# EAGLE design PowerBoard (EAGLE 6.5.0)
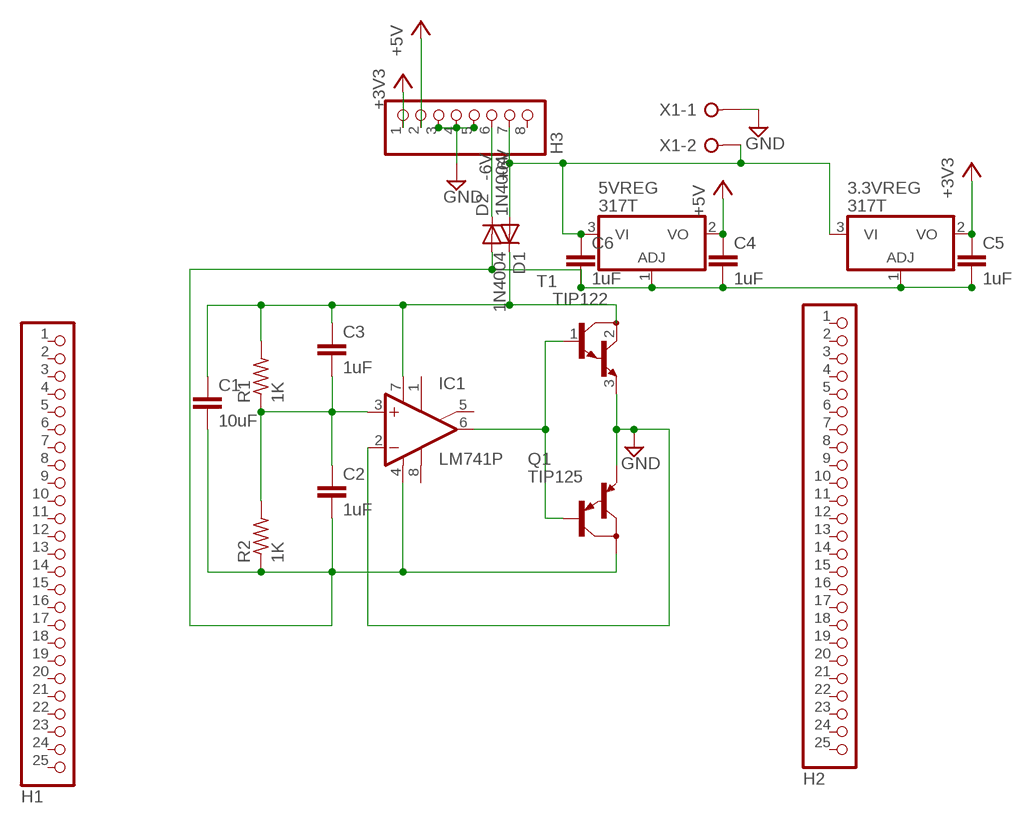
[diagram p0: schematic, sheet 1]

## Parts
3.3VREG  317T  [TO220H]
5VREG  317T  [TO220H]
C1  10uF  C2.5/2  [C2.5-2]
C2  1uF  C2.5/2  [C2.5-2]
C3  1uF  C2.5/2  [C2.5-2]
C4  1uF  C2.5/2  [C2.5-2]
C5  1uF  C2.5/2  [C2.5-2]
C6  1uF  C2.5/2  [C2.5-2]
D1  1N4004  [DO41-10]
D2  1N4004  [DO41-10]
GYH1  H1  PINHD-1X25  [1X25]
IC1  LM741P  [DIL08]
JP2  H2  PINHD-1X25  [1X25]
JP3  H3  PINHD-1X8  [1X08]
Q1  TIP125  [TO220]
R1  1K  R-US_0207/7  [0207/7]
R2  1K  R-US_0207/7  [0207/7]
T1  TIP122  [TO220]
X1  W237-02P  [W237-132]

## Nets
+3V3: 3.3VREG.2(VO) C5.1 JP3.1
+5V: 5VREG.2(VO) C4.1 JP3.2
GND: IC1.2(-IN) JP3.3 JP3.4 JP3.5 Q1.3(E) T1.3(E) X1.1
N$1: 3.3VREG.3(VI) 5VREG.3(VI) C6.1 D1.A JP3.7 X1.2
N$2: 3.3VREG.1(ADJ) 5VREG.1(ADJ) C1.2 C2.2 C4.2 C5.2 C6.2 D2.A IC1.4(V-) Q1.2(C) R2.1
N$3: D2.C JP3.6
N$4: C1.1 C3.1 D1.C IC1.7(V+) R1.2 T1.2(C)
N$5: IC1.6(OUT) Q1.1(B) T1.1(B)
N$6: C2.1 C3.2 IC1.3(+IN) R1.1 R2.2
Unconnected: GYH1.1 GYH1.2 GYH1.3 GYH1.4 GYH1.5 GYH1.6 GYH1.7 GYH1.8 GYH1.9 GYH1.10 GYH1.11 GYH1.12 GYH1.13 GYH1.14 GYH1.15 GYH1.16 GYH1.17 GYH1.18 GYH1.19 GYH1.20 GYH1.21 GYH1.22 GYH1.23 GYH1.24 GYH1.25 IC1.1(ON1) IC1.5(ON2) IC1.8(OPT) JP2.1 JP2.2 JP2.3 JP2.4 JP2.5 JP2.6 JP2.7 JP2.8 JP2.9 JP2.10 JP2.11 JP2.12 JP2.13 JP2.14 JP2.15 JP2.16 JP2.17 JP2.18 JP2.19 JP2.20 JP2.21 JP2.22 JP2.23 JP2.24 JP2.25 JP3.8

## Notes on the sheet
- -6V | +6V

## Library data of the parts
3.3VREG 5VREG = linear:*317: Positive VOLTAGE REGULATOR
C1-C6 = capacitor-wima:C: CAPACITOR naming: grid - package width
D1 D2 = diode:1N4004: DIODE general purpose rectifier, 1 A
GYH1 JP2 = pinhead:PINHD-1X25: PIN HEADER
IC1 = linear:*741: OP AMP
JP3 = pinhead:PINHD-1X8: PIN HEADER
Q1 = transistor-pnp:TIP125: PNP Transistor
R1 R2 = resistor:R-US_: RESISTOR, American symbol
T1 = transistor:TIP122: NPN BIPOLAR DARLINGTON TRANSISTOR
X1 = con-wago-508:W237-02P: WAGO SREW CLAMP; OC_FARNELL: unknown; OC_NEWARK: unknown

## Board
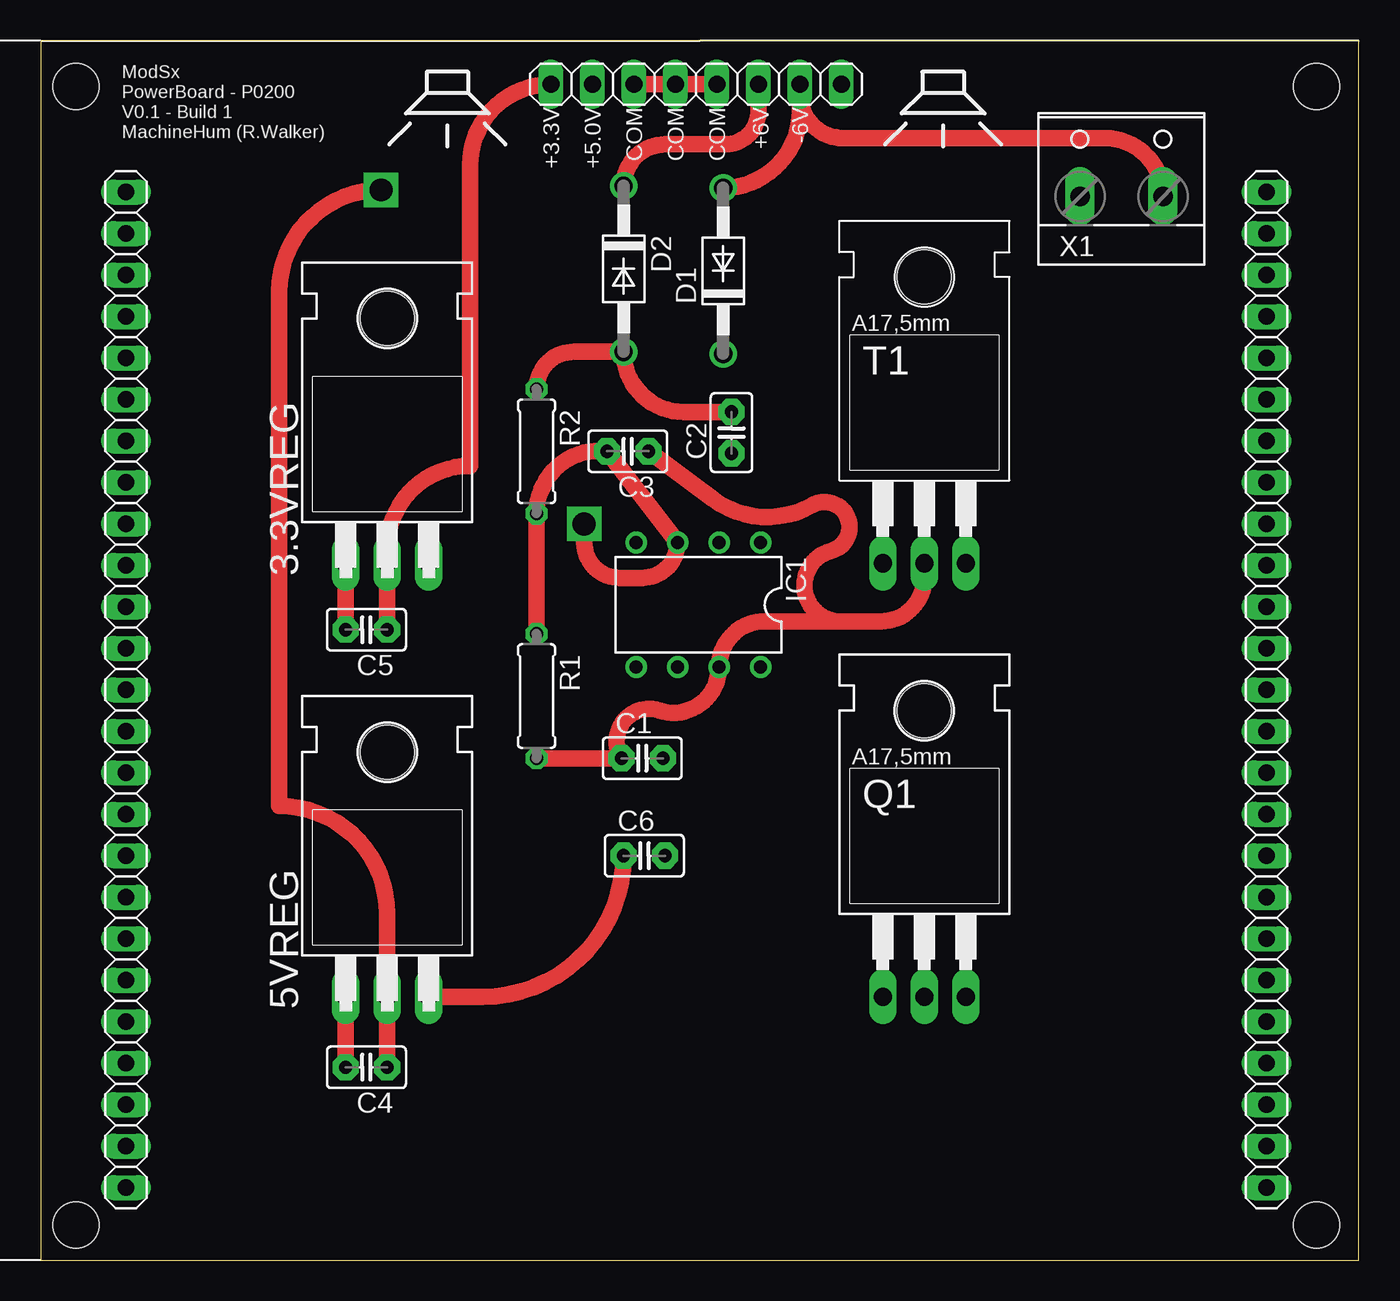
[diagram p1: board, top side]
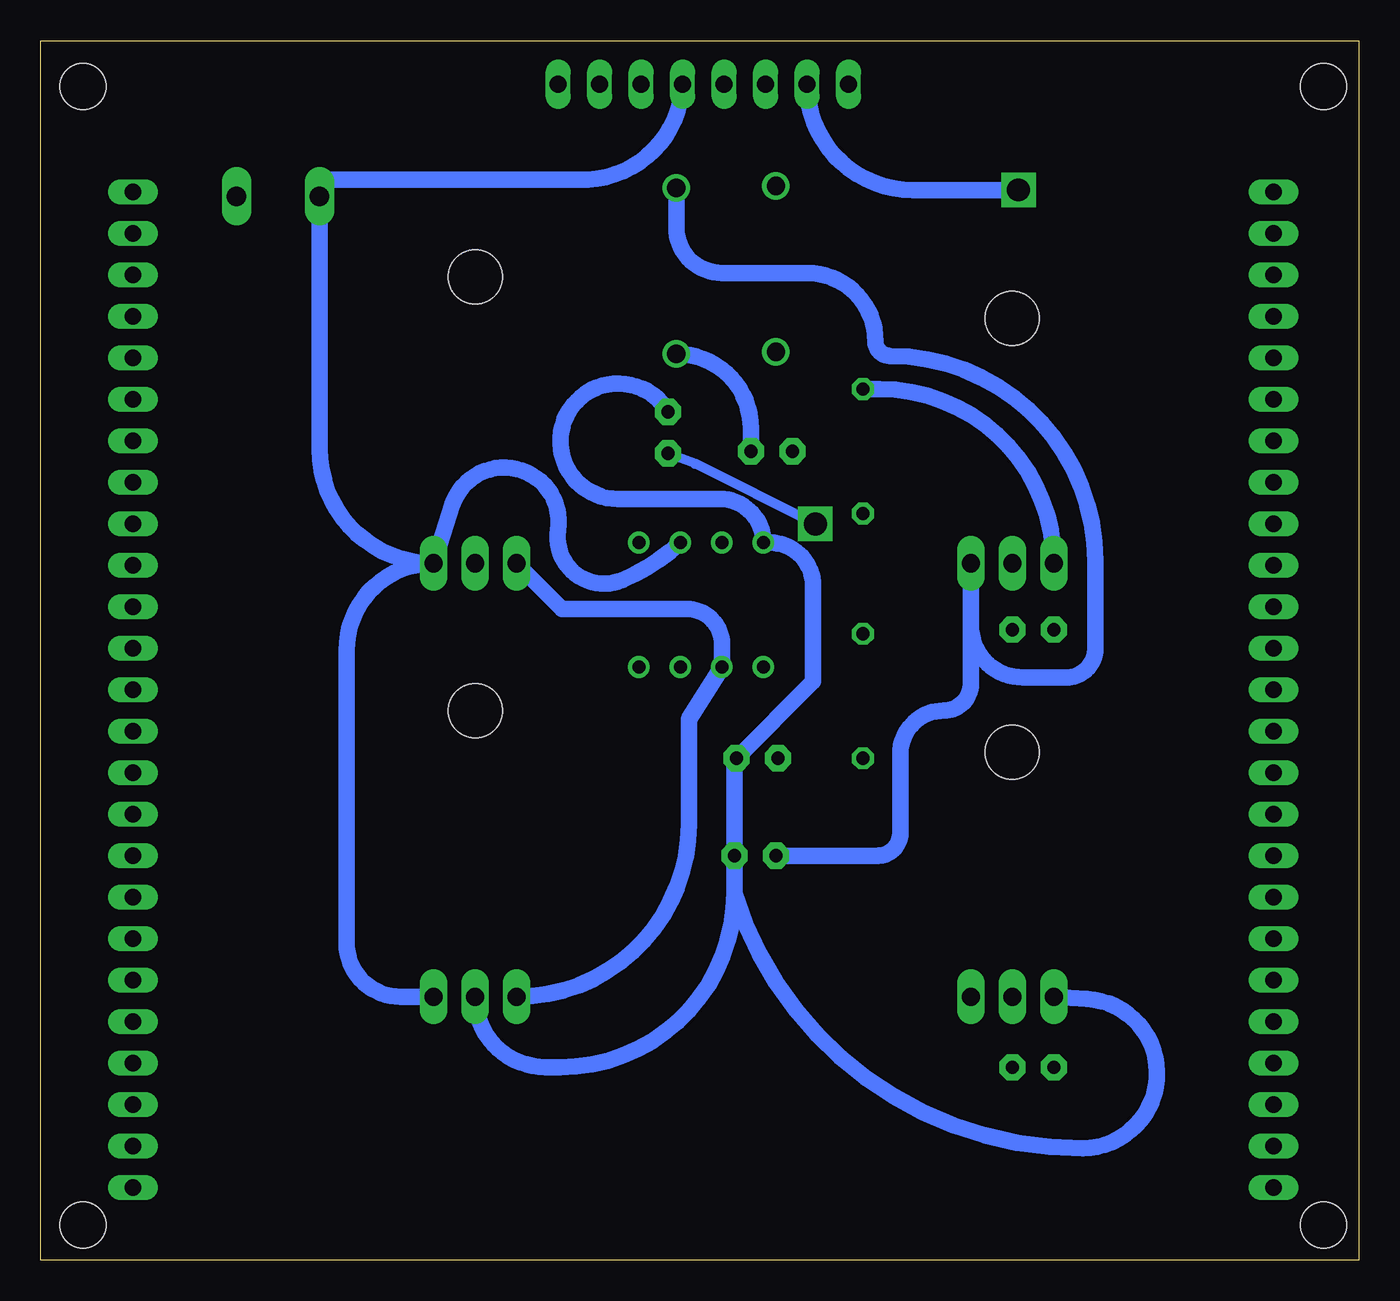
[diagram p2: board, bottom side, seen from below]

Size 80.7 x 74.67 mm. Coordinates in mm from the lower left corner, seen from the top.
Outline: 0,0 80.7,0 80.7,74.67 0,74.67 0,0
Copper layers (1*16): Top 0.035mm / dielectric 1.5mm / Bottom 0.035mm
Design rules "default": minimum track width 10mil, minimum drill 24mil, track to track 8mil, track to pad 8mil, pad to pad 8mil, via to via 8mil, smd to smd 8mil, copper to edge 40mil, drill to drill 8mil, minimum pad ring 10mil, minimum via ring 8mil, stop-mask expansion 4mil, vias tented up to drill 0mil, thermal gap 10mil
Holes 2.8 mm at 2.16,71.88 2.16,2.16 78.11,71.88 78.11,2.16

### Footprints (pad centres in the part's own frame; a part is rotated, then mirrored left to right if it is on the bottom)
TO220H = drill 1.118 long: 1 -2.54,-10.16; 2 0,-10.16; 3 2.54,-10.16 | hole 3.302: 0,4.826
C2.5-2 = drill 0.813 pad 1.6 octagon: 1 -1.27,0; 2 1.27,0
DO41-10 = drill 1.118: A 5.08,0; C -5.08,0
1X25 = drill 1.016 long: 1 -29.21,0; 2 -26.67,0; 3 -24.13,0; 4 -21.59,0; 5 -19.05,0; 6 -16.51,0; 7 -13.97,0; 8 -11.43,0; 9 -8.89,0; 10 -6.35,0; 11 -3.81,0; 12 -1.27,0; 13 1.27,0; 14 3.81,0; 15 6.35,0; 16 8.89,0; 17 11.43,0; 18 13.97,0; 19 16.51,0; 20 19.05,0; 21 21.59,0; 22 24.13,0; 23 26.67,0; 24 29.21,0; 25 31.75,0
DIL08 = drill 0.813 pad 1.27: 1 -3.81,-3.81; 2 -1.27,-3.81; 3 1.27,-3.81; 4 3.81,-3.81; 5 3.81,3.81; 6 1.27,3.81; 7 -1.27,3.81; 8 -3.81,3.81
1X08 = drill 1.016 long: 1 -8.89,0; 2 -6.35,0; 3 -3.81,0; 4 -1.27,0; 5 1.27,0; 6 3.81,0; 7 6.35,0; 8 8.89,0
TO220 = drill 1.118 long: 1 -2.54,-6.35; 2 0,-6.35; 3 2.54,-6.35 | hole 3.302: 0,11.176
0207/7 = drill 0.813 octagon: 1 -3.81,0; 2 3.81,0
W237-132 = drill 1.194 long: 1 -2.54,-0.635; 2 2.54,-0.635

### Placement (x,y rotation side)
3.3VREG  21.21,52.83 0 top
5VREG  21.21,26.29 0 top
C1  36.83,30.73 0 top
C2  42.29,50.67 90 top
C3  35.94,49.53 180 top
C4  19.94,11.81 180 top
C5  19.94,38.61 180 top
C6  36.96,24.77 0 top
D1  41.78,60.58 90 top
D2  35.69,60.71 270 top
GYH1  5.21,36.2 270 top
IC1  40.26,40.13 180 top
JP2  75.06,36.2 270 top
JP3  40.13,72.01 0 top
Q1  54.1,22.48 0 top
R1  30.35,34.54 270 top
R2  30.35,49.53 270 top
T1  54.1,49.02 0 top
X1  66.17,65.79 0 top

### Tracks (layer width: path | path; a pad name or v marks a point on that pad's centre or on a via)
+3V3
  Top 1.016: JP3.1 arc90 26.29,67.06 26.29,48.64 arc90 21.21,43.56 3.3VREG.2 C5.1
+5V  (via drill 1.4)
  Top 1.016: C4.1 5VREG.2 21.21,21.21 arc90 14.61,27.81 14.61,59.31 arc-90 v20.83,65.53
  Bottom 1.016: v20.83,65.53 27.3,65.53 arc90 JP3.2
GND
  Top 1.016: JP3.5 JP3.4 JP3.3
  Bottom 1.016: T1.3 arc90 63.63,49.66 X1.1 arc90 63.12,66.17 47.75,66.17 arc-90 JP3.5 | T1.3 arc-90 61.98,37.34 61.98,19.43 arc-90 58.67,16.13 Q1.3 | T1.3 55.5,46.23 arc171 49.02,44.7 arc-122 45.09,41.66 arc-19 IC1.2
N$1
  Top 1.016: D1.A arc90 46.48,70.36 JP3.7 46.48,71.37 arc90 49.15,68.71 65.15,68.71 arc-90 X1.2 | 5VREG.3 27.05,16.13 arc90 C6.1
  Bottom 1.016: C6.1 29.46,24.77 arc-90 28.07,26.16 28.07,30.99 arc90 25.4,33.66 arc-90 23.75,35.31 3.3VREG.3 23.75,38.86 arc-90 20.57,35.69 17.91,35.69 arc-90 16.13,37.47 16.13,42.8 arc-90 28.7,55.37 arc90 29.59,56.26 arc-90 33.78,60.45 38.99,60.45 arc90 41.78,63.25 D1.A
N$2
  Top 1.016: R2.1 arc-90 32.64,55.63 D2.A arc90 39.37,51.94 C2.2 | C4.2 5VREG.1 | 3.3VREG.1 C5.2
  Bottom 1.016: 3.3VREG.1 arc-90 29.34,53.34 R2.1 | Q1.2 arc-90 49.78,11.81 48.9,11.81 arc-90 38.23,22.48 | 38.23,22.48 C6.2 38.23,30.61 arc90 C1.2 33.4,35.43 33.4,41.27 arc-90 36.07,43.94 IC1.4 arc-90 39.12,46.61 45.34,46.61 arc239 C2.2 | 5VREG.1 16.64,16 arc176 16.89,6.86 arc73 38.23,22.48
N$3
  Top 1.016: D2.C arc-90 38.23,68.33 41.91,68.33 arc90 43.94,70.36 JP3.6
N$4
  Top 1.016: R1.2 C1.1 arc-140 37.85,33.66 arc108 IC1.7 arc-90 44.32,39.12 49.02,39.12 | T1.2 54.1,41.78 arc-90 51.44,39.12 49.02,39.12 | C3.1 41.15,46.61 arc66 47.24,46.23 arc-194 48.39,43.43 arc167 49.02,39.12
  Bottom 1.016: C3.1 37.21,50.93 arc-90 D1.C
N$5
  Bottom 1.016: T1.1 48.77,39.88 41.15,39.88 arc90 38.99,37.72 IC1.6 41.02,33.15 41.02,26.67 arc90 Q1.1
N$6  (via drill 1.4)
  Top 1.016: R1.1 R2.2 arc-97 C3.2 IC1.3 arc-90 36.83,41.78 35.43,41.78 arc-90 33.27,43.94 v33.27,45.09
  Bottom 0.61: v33.27,45.09 40.64,48.77 C2.1

### Text on the board
tPlace: +3.3V | +5.0V | COM | COM | COM | +6V | -6V | ModSx / PowerBoard - P0200 / V0.1 - Build 1 / MachineHum (R.Walker)